# Altium schematic sheet mcu.SchDoc
size A3
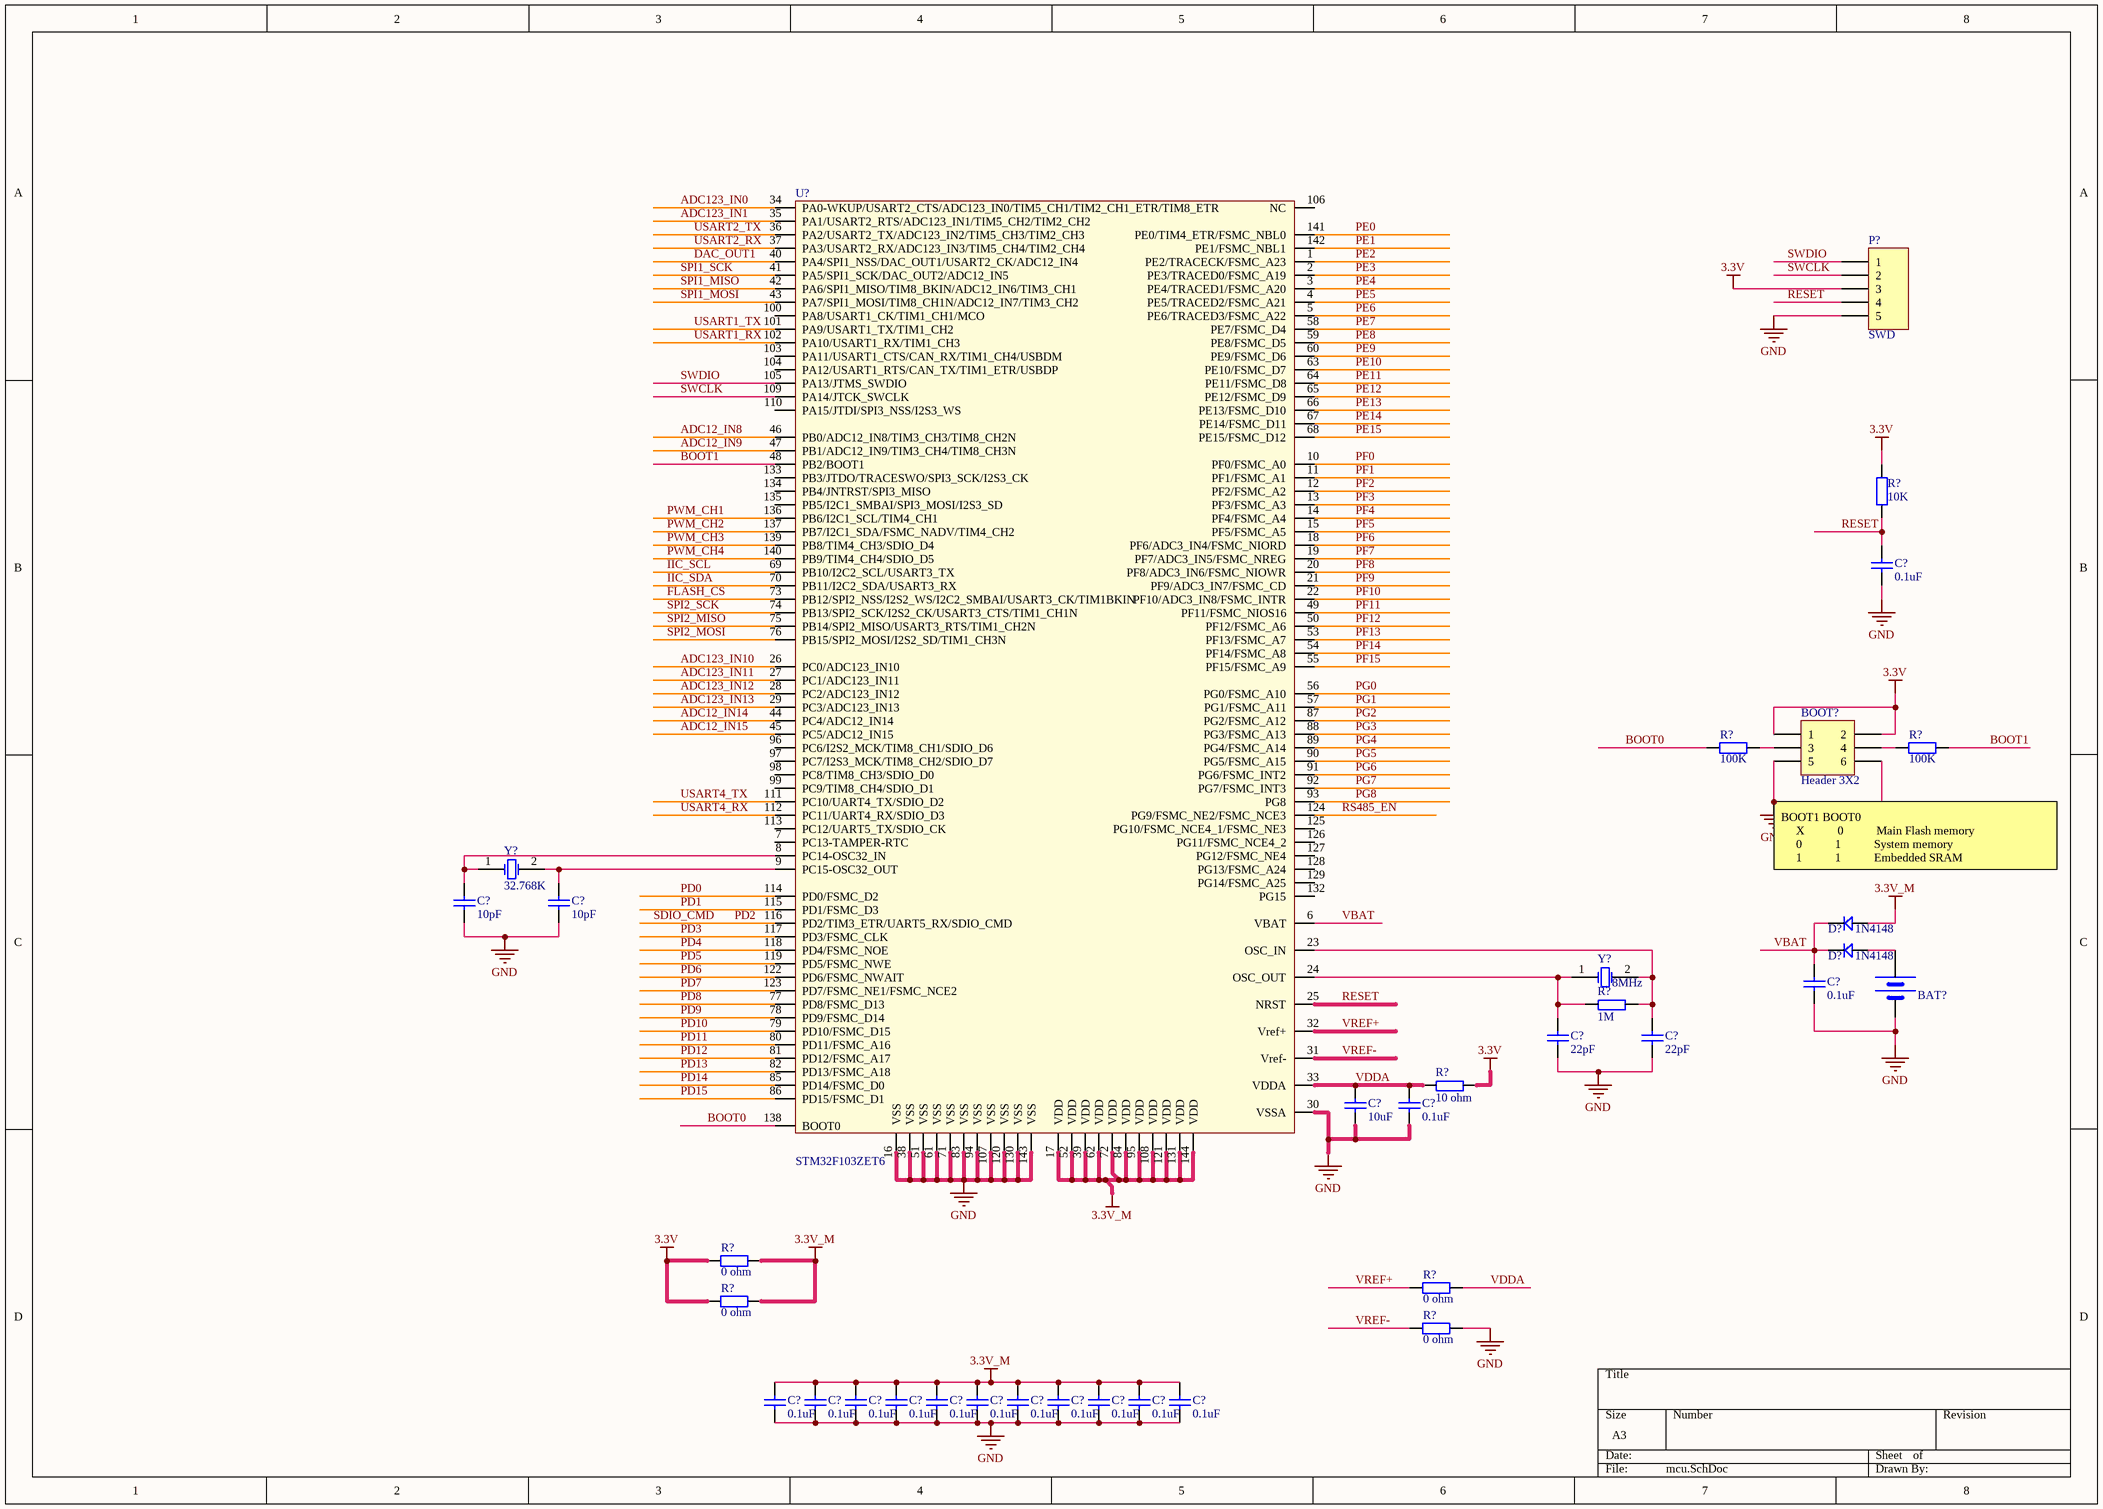
[diagram p0: mcu.SchDoc]

## Parts
(Parts that share a designator on the sheet are numbered #1, #2 ... from top to bottom, then left to right.)
BAT?  BATT  [BATM]  (value not drawn)
BOOT?  Header 3X2  [HDR2X3]
C?#1  value 0.1uF  [0805]  (hidden comment: Cap)
C?#2  value 10pF  [0805]  (hidden comment: Cap)
C?#3  value 10pF  [0805]  (hidden comment: Cap)
C?#4  value 0.1uF  [0805]  (hidden comment: Cap)
C?#5  value 22pF  [0805]  (hidden comment: Cap)
C?#6  value 22pF  [0805]  (hidden comment: Cap)
C?#7  value 10uF  [1206]  (hidden comment: Cap)
C?#8  value 0.1uF  [0805]  (hidden comment: Cap)
C?#9  value 0.1uF  [0805]  (hidden comment: Cap)
C?#10  value 0.1uF  [0805]  (hidden comment: Cap)
C?#11  value 0.1uF  [0805]  (hidden comment: Cap)
C?#12  value 0.1uF  [0805]  (hidden comment: Cap)
C?#13  value 0.1uF  [0805]  (hidden comment: Cap)
C?#14  value 0.1uF  [0805]  (hidden comment: Cap)
C?#15  value 0.1uF  [0805]  (hidden comment: Cap)
C?#16  value 0.1uF  [0805]  (hidden comment: Cap)
C?#17  value 0.1uF  [0805]  (hidden comment: Cap)
C?#18  value 0.1uF  [0805]  (hidden comment: Cap)
C?#19  value 0.1uF  [0805]  (hidden comment: Cap)
D?#1  1N4148  [DIODE_SOP]
D?#2  1N4148  [DIODE_SOP]
P?  SWD  [HDR1X5]
R?#1  value 10K  [0805]
R?#2  value 100K  [0805]
R?#3  value 100K  [0805]
R?#4  1M  [0805]
R?#5  10 ohm  [0805]
R?#6  value 0 ohm  [0805]
R?#7  value 0 ohm  [0805]
R?#8  value 0 ohm  [0805]
R?#9  value 0 ohm  [0805]
U?  STM32F103ZET6  [LQFP144]
Y?#1  32.768K  [XTAL32]
Y?#2  8MHz  [XTAL_US]

## Nets
3.3V: BOOT?.1 BOOT?.2 P?.3 R?#1.2 R?#5.2 R?#6.2 R?#8.2
3.3V_M: C?#9.2 C?#10.2 C?#11.2 C?#12.2 C?#13.2 C?#14.2 C?#15.2 C?#16.2 C?#17.2 C?#18.2 C?#19.2 D?#1.1 R?#6.1 R?#8.1 U?.17(VDD) U?.39(VDD) U?.52(VDD) U?.62(VDD) U?.72(VDD) U?.84(VDD) U?.95(VDD) U?.108(VDD) U?.121(VDD) U?.131(VDD) U?.144(VDD)
GND: BAT?.2(GND) BOOT?.5 BOOT?.6 C?#1.1 C?#2.1 C?#3.1 C?#4.1 C?#5.1 C?#6.1 C?#7.1 C?#8.1 C?#9.1 C?#10.1 C?#11.1 C?#12.1 C?#13.1 C?#14.1 C?#15.1 C?#16.1 C?#17.1 C?#18.1 C?#19.1 P?.5 R?#9.1 U?.16(VSS) U?.30(VSSA) U?.38(VSS) U?.51(VSS) U?.61(VSS) U?.71(VSS) U?.83(VSS) U?.94(VSS) U?.107(VSS) U?.120(VSS) U?.130(VSS) U?.143(VSS)
ADC12_IN8: U?.46(PB0/ADC12_IN8/TIM3_CH3/TIM8_CH2N)
ADC12_IN9: U?.47(PB1/ADC12_IN9/TIM3_CH4/TIM8_CH3N)
ADC12_IN14: U?.44(PC4/ADC12_IN14)
ADC12_IN15: U?.45(PC5/ADC12_IN15)
ADC123_IN0: U?.34(PA0-WKUP/USART2_CTS/ADC123_IN0/TIM5_CH1/TIM2_CH1_ETR/TIM8_ETR)
ADC123_IN1: U?.35(PA1/USART2_RTS/ADC123_IN1/TIM5_CH2/TIM2_CH2)
ADC123_IN10: U?.26(PC0/ADC123_IN10)
ADC123_IN11: U?.27(PC1/ADC123_IN11)
ADC123_IN12: U?.28(PC2/ADC123_IN12)
ADC123_IN13: U?.29(PC3/ADC123_IN13)
BOOT0: R?#2.2 U?.138(BOOT0)
BOOT1: R?#3.1 U?.48(PB2/BOOT1)
DAC_OUT1: U?.40(PA4/SPI1_NSS/DAC_OUT1/USART2_CK/ADC12_IN4)
FLASH_CS: U?.73(PB12/SPI2_NSS/I2S2_WS/I2C2_SMBAI/USART3_CK/TIM1BKIN)
IIC_SCL: U?.69(PB10/I2C2_SCL/USART3_TX)
IIC_SDA: U?.70(PB11/I2C2_SDA/USART3_RX)
PD0: U?.114(PD0/FSMC_D2)
PD1: U?.115(PD1/FSMC_D3)
PD2: U?.116(PD2/TIM3_ETR/UART5_RX/SDIO_CMD)  [also labelled SDIO_CMD]
PD3: U?.117(PD3/FSMC_CLK)
PD4: U?.118(PD4/FSMC_NOE)
PD5: U?.119(PD5/FSMC_NWE)
PD6: U?.122(PD6/FSMC_NWAIT)
PD7: U?.123(PD7/FSMC_NE1/FSMC_NCE2)
PD8: U?.77(PD8/FSMC_D13)
PD9: U?.78(PD9/FSMC_D14)
PD10: U?.79(PD10/FSMC_D15)
PD11: U?.80(PD11/FSMC_A16)
PD12: U?.81(PD12/FSMC_A17)
PD13: U?.82(PD13/FSMC_A18)
PD14: U?.85(PD14/FSMC_D0)
PD15: U?.86(PD15/FSMC_D1)
PE0: U?.141(PE0/TIM4_ETR/FSMC_NBL0)
PE1: U?.142(PE1/FSMC_NBL1)
PE2: U?.1(PE2/TRACECK/FSMC_A23)
PE3: U?.2(PE3/TRACED0/FSMC_A19)
PE4: U?.3(PE4/TRACED1/FSMC_A20)
PE5: U?.4(PE5/TRACED2/FSMC_A21)
PE6: U?.5(PE6/TRACED3/FSMC_A22)
PE7: U?.58(PE7/FSMC_D4)
PE8: U?.59(PE8/FSMC_D5)
PE9: U?.60(PE9/FSMC_D6)
PE10: U?.63(PE10/FSMC_D7)
PE11: U?.64(PE11/FSMC_D8)
PE12: U?.65(PE12/FSMC_D9)
PE13: U?.66(PE13/FSMC_D10)
PE14: U?.67(PE14/FSMC_D11)
PE15: U?.68(PE15/FSMC_D12)
PF0: U?.10(PF0/FSMC_A0)
PF1: U?.11(PF1/FSMC_A1)
PF2: U?.12(PF2/FSMC_A2)
PF3: U?.13(PF3/FSMC_A3)
PF4: U?.14(PF4/FSMC_A4)
PF5: U?.15(PF5/FSMC_A5)
PF6: U?.18(PF6/ADC3_IN4/FSMC_NIORD)
PF7: U?.19(PF7/ADC3_IN5/FSMC_NREG)
PF8: U?.20(PF8/ADC3_IN6/FSMC_NIOWR)
PF9: U?.21(PF9/ADC3_IN7/FSMC_CD)
PF10: U?.22(PF10/ADC3_IN8/FSMC_INTR)
PF11: U?.49(PF11/FSMC_NIOS16)
PF12: U?.50(PF12/FSMC_A6)
PF13: U?.53(PF13/FSMC_A7)
PF14: U?.54(PF14/FSMC_A8)
PF15: U?.55(PF15/FSMC_A9)
PG0: U?.56(PG0/FSMC_A10)
PG1: U?.57(PG1/FSMC_A11)
PG2: U?.87(PG2/FSMC_A12)
PG3: U?.88(PG3/FSMC_A13)
PG4: U?.89(PG4/FSMC_A14)
PG5: U?.90(PG5/FSMC_A15)
PG6: U?.91(PG6/FSMC_INT2)
PG7: U?.92(PG7/FSMC_INT3)
PG8: U?.93(PG8)
PWM_CH1: U?.136(PB6/I2C1_SCL/TIM4_CH1)
PWM_CH2: U?.137(PB7/I2C1_SDA/FSMC_NADV/TIM4_CH2)
PWM_CH3: U?.139(PB8/TIM4_CH3/SDIO_D4)
PWM_CH4: U?.140(PB9/TIM4_CH4/SDIO_D5)
RESET: C?#1.2 P?.4 R?#1.1 U?.25(NRST)
RS485_EN: U?.124(PG9/FSMC_NE2/FSMC_NCE3)
SPI1_MISO: U?.42(PA6/SPI1_MISO/TIM8_BKIN/ADC12_IN6/TIM3_CH1)
SPI1_MOSI: U?.43(PA7/SPI1_MOSI/TIM8_CH1N/ADC12_IN7/TIM3_CH2)
SPI1_SCK: U?.41(PA5/SPI1_SCK/DAC_OUT2/ADC12_IN5)
SPI2_MISO: U?.75(PB14/SPI2_MISO/USART3_RTS/TIM1_CH2N)
SPI2_MOSI: U?.76(PB15/SPI2_MOSI/I2S2_SD/TIM1_CH3N)
SPI2_SCK: U?.74(PB13/SPI2_SCK/I2S2_CK/USART3_CTS/TIM1_CH1N)
SWCLK: P?.2 U?.109(PA14/JTCK_SWCLK)
SWDIO: P?.1 U?.105(PA13/JTMS_SWDIO)
USART1_RX: U?.102(PA10/USART1_RX/TIM1_CH3)
USART1_TX: U?.101(PA9/USART1_TX/TIM1_CH2)
USART2_RX: U?.37(PA3/USART2_RX/ADC123_IN3/TIM5_CH4/TIM2_CH4)
USART2_TX: U?.36(PA2/USART2_TX/ADC123_IN2/TIM5_CH3/TIM2_CH3)
USART4_RX: U?.112(PC11/UART4_RX/SDIO_D3)
USART4_TX: U?.111(PC10/UART4_TX/SDIO_D2)
VBAT: C?#4.2 D?#1.2 D?#2.2 U?.6(VBAT)
VDDA: C?#7.2 C?#8.2 R?#5.1 R?#7.1 U?.33(VDDA)
VREF+: R?#7.2 U?.32(Vref+)
VREF-: R?#9.2 U?.31(Vref-)
NetBAT?_1: BAT?.1(VCC) D?#2.1
NetBOOT?_3: BOOT?.3 R?#2.1
NetBOOT?_4: BOOT?.4 R?#3.2
NetC?#2_2: C?#2.2 U?.8(PC14-OSC32_IN) Y?#1.1(OSC1)
NetC?#3_2: C?#3.2 U?.9(PC15-OSC32_OUT) Y?#1.2(OSC2)
NetC?#5_2: C?#5.2 R?#4.1 U?.24(OSC_OUT) Y?#2.1(OSC1)
NetC?#6_2: C?#6.2 R?#4.2 U?.23(OSC_IN) Y?#2.2(OSC2)

Not connected (* = marked no-connect by the designer): U? 7(PC13-TAMPER-RTC) 96(PC6/I2S2_MCK/TIM8_CH1/SDIO_D6) 97(PC7/I2S3_MCK/TIM8_CH2/SDIO_D7) 98(PC8/TIM8_CH3/SDIO_D0) 99(PC9/TIM8_CH4/SDIO_D1) 100(PA8/USART1_CK/TIM1_CH1/MCO) 103(PA11/USART1_CTS/CAN_RX/TIM1_CH4/USBDM) 104(PA12/USART1_RTS/CAN_TX/TIM1_ETR/USBDP) 106(NC) 110(PA15/JTDI/SPI3_NSS/I2S3_WS) 113(PC12/UART5_TX/SDIO_CK) 125(PG10/FSMC_NCE4_1/FSMC_NE3) 126(PG11/FSMC_NCE4_2) 127(PG12/FSMC_NE4) 128(PG13/FSMC_A24) 129(PG14/FSMC_A25) 132(PG15) 133(PB3/JTDO/TRACESWO/SPI3_SCK/I2S3_CK) 134(PB4/JNTRST/SPI3_MISO) 135(PB5/I2C1_SMBAI/SPI3_MOSI/I2S3_SD)

## Notes on the sheet
- BOOT1 BOOT0
  X           0           Main Flash memory
  0           1           System memory
  1           1           Embedded SRAM

## Library data of the parts
BAT? = BAT
BOOT? = Header 3X2: Header, 3-Pin, Dual row; LatestRevisionDate: 17-Jul-2002; LatestRevisionNote: Re-released for DXP Platform.; Publisher: Altium Limited
C?#1-C?#19 = Cap: Capacitor; Published: 8-Jun-2000; LatestRevisionDate: 17-Jul-2002; LatestRevisionNote: Re-released for DXP Platform.; PackageReference: RAD-0.3; Publisher: Altium Limited; PackageDescription: Radial Cap, Thru-Hole; 2 Leads; 0.3 in Pin Spacing
D?#1 D?#2 = D
P? = Header 5: Header, 5-Pin; LatestRevisionDate: 17-Jul-2002; LatestRevisionNote: Re-released for DXP Platform.; Publisher: Altium Limited
R?#1-R?#3 R?#6-R?#9 = Res2: Resistor; Published: 8-Jun-2000; LatestRevisionDate: 17-Jul-2002; LatestRevisionNote: Re-released for DXP Platform.; PackageReference: AXIAL-0.4; Publisher: Altium Limited; PackageDescription: Axial Device, Thru-Hole; 2 Leads; 0.4 in Pin Spacing
R?#4 R?#5 = R
Y?#1 = XTAL_1: Crystal Oscillator; Published: 8-Jun-2000; LatestRevisionDate: 17-Jul-2002; LatestRevisionNote: Re-released for DXP Platform.; Publisher: Altium Limited
Y?#2 = XTAL: Crystal Oscillator; Published: 8-Jun-2000; LatestRevisionDate: 17-Jul-2002; LatestRevisionNote: Re-released for DXP Platform.; Publisher: Altium Limited